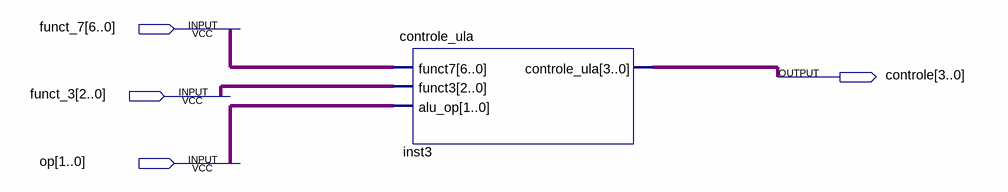
[diagram p0: schematic sheet]
// Quartus schematic teste_controle_ula.bdf as structural Verilog: 1 symbols, 4 pins
module teste_controle_ula (
  input  [6:0] funct_7,
  input  [2:0] funct_3,
  input  [1:0] op,
  output [3:0] controle
);

  wire [1:0] undriven_3;
  wire [2:0] undriven_2;
  wire [6:0] undriven;

  controle_ula inst3 (.funct7(undriven), .funct3(undriven_2), .alu_op(undriven_3), .controle_ula(controle));
endmodule
